# EAGLE design ace128tiny (EAGLE 9.6.2)
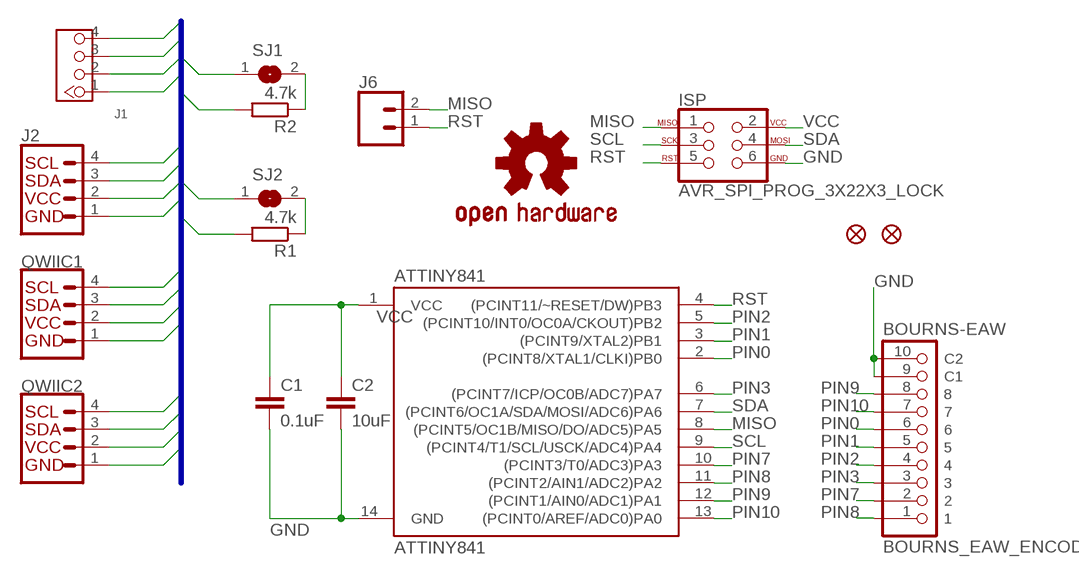
[diagram p0: schematic, sheet 1]

## Parts
ATTINY841  ATTINY841  ATTINY84  [SO14]
BOURNS_EAW_ENCODER  BOURNS-EAW  [BOURNS-EAW]
C1  0.1uF  C-EUC0603  [C0603]
C2  10uF  C-EUC0805  [C0805]
FD1  FIDUCIAL1X2  [FIDUCIAL-1X2]
FD2  FIDUCIAL1X2  [FIDUCIAL-1X2]
ISP  AVR_SPI_PROG_3X22X3_LOCK  [2X3_LOCK]
J1  GROVE I2C  GROVE-CONNECTOR-DIP(4P-2.0)HW4-2.0-NO-OUTLINE  [HW4-2.0-NO-OUTLINE]
J2  I2C_STANDARD  [1X04]
J6  CONN_02  [1X02]
LOGO1  OSHW-LOGOS  [OSHW-LOGO-S]
QWIIC1  QWIIC_CONNECTORJS-1MM  [1X04_1MM_RA]
QWIIC2  QWIIC_CONNECTORJS-1MM  [1X04_1MM_RA]
R1  4.7k  R-EU_R0603  [R0603]
R2  4.7k  R-EU_R0603  [R0603]
SJ1  SJ  [SJ]
SJ2  SJ  [SJ]

## Nets
GND: ATTINY841.14(GND) BOURNS_EAW_ENCODER.9(C1) BOURNS_EAW_ENCODER.10(C2) C1.2 C2.2 ISP.6 J1.4 J2.1 QWIIC1.1(GND) QWIIC2.1(GND)
MISO: ATTINY841.8((PCINT5/OC1B/MISO/DO/ADC5)PA5) ISP.1 J6.2
N$1: R2.1 SJ1.2
N$10: R1.1 SJ2.2
PIN0: ATTINY841.2((PCINT8/XTAL1/CLKI)PB0) BOURNS_EAW_ENCODER.6
PIN1: ATTINY841.3((PCINT9/XTAL2)PB1) BOURNS_EAW_ENCODER.5
PIN2: ATTINY841.5((PCINT10/INT0/OC0A/CKOUT)PB2) BOURNS_EAW_ENCODER.4
PIN3: ATTINY841.6((PCINT7/ICP/OC0B/ADC7)PA7) BOURNS_EAW_ENCODER.3
PIN7: ATTINY841.10((PCINT3/T0/ADC3)PA3) BOURNS_EAW_ENCODER.2
PIN8: ATTINY841.11((PCINT2/AIN1/ADC2)PA2) BOURNS_EAW_ENCODER.1
PIN9: ATTINY841.12((PCINT1/AIN0/ADC1)PA1) BOURNS_EAW_ENCODER.8
PIN10: ATTINY841.13((PCINT0/AREF/ADC0)PA0) BOURNS_EAW_ENCODER.7
RST: ATTINY841.4((PCINT11/~RESET/DW)PB3) ISP.5 J6.1
SCL: ATTINY841.9((PCINT4/T1/SCL/USCK/ADC4)PA4) ISP.3 J1.1 J2.4 QWIIC1.4(SCL) QWIIC2.4(SCL) SJ1.1
SDA: ATTINY841.7((PCINT6/OC1A/SDA/MOSI/ADC6)PA6) ISP.4 J1.2 J2.3 QWIIC1.3(SDA) QWIIC2.3(SDA) SJ2.1
VCC: ATTINY841.1(VCC) C1.1 C2.1 ISP.2 J1.3 J2.2 QWIIC1.2(VCC) QWIIC2.2(VCC) R1.2 R2.2

## Buses
I2C:GND,SCL,SDA,VCC

## Library data of the parts
ATTINY841 = SparkFun-IC-Microcontroller:ATTINY84: Atmel 14-pin 2/4/8kB flash uC Datasheet <https://cdn.sparkfun.com/datasheets/Widgets/doc8006.pdf> SparkFun Products Tiny AVR Programmer <https://www.sparkfun.com/products/11801> (PGM-11801) SparkFun Servo Trigger - Continuous Rotation <https://www.sparkfun.com/products/13872> (WIG-13872) SparkFun Servo Trigger <https://www.sparkfun.com/products/13118> (WIG-13118); PROD_ID: IC-11285; VALUE: ATTINY84
BOURNS_EAW_ENCODER = redhunter:BOURNS-EAW: Bourns EAW0J-C24 Absolute Contacting Encoder (ACE)
C1 C2 = rcl:C-EU: CAPACITOR, European symbol
FD1 FD2 = SparkFun-Aesthetics:FIDUCIAL: Fiducial Alignment Points Point-of-reference for pick-and-place machines and other optical instruments.
ISP = SparkFun-Connectors:AVR_SPI_PROG_3X2: AVR ISP 6 Pin This is the reduced ISP connector for AVR programming. Common on Arduino. This footprint will take up less PCB space and can be used with a 10-pin to 6-pin adapter such as SKU: BOB-08508 **Special note about "TEST_POINT" package. The stop mask is on the top side, so if you want your programming test points to be on the bottom of your board, make sure to place this package on the bottom side of the board. This also ensure that the orientation to program from the bottom side will be correct. SparkFun Products: SparkFun ISP Pogo Adapter <https://www.sparkfun.com/products/11591> - NS Tiny AVR Programmer <https://www.sparkfun.com/products/11801> -PTH
J1 = redhunter:GROVE-CONNECTOR-DIP(4P-2.0): 320110033
J2 = SparkFun-Connectors:I2C_STANDARD: SparkFun I2C Standard Pinout Header SparkFun has standardized on a pinout for all I2C based sensor breakouts. This pinout allows I2C boards to be plugged directly into the headers on Arduino Uno compatible boards, and to be daisy chained easily. Example SparkFun Products: SparkFun Atmospheric Sensor Breakout - BME280 <https://www.sparkfun.com/products/13676> SparkFun Altitude/Pressure Sensor Breakout - MPL3115A2 <https://www.sparkfun.com/products/11084> SparkFun TOF Range Finder Sensor - VL6180 <https://www.sparkfun.com/products/12785>
J6 = SparkFun-Connectors:CONN_02: Multi connection point. Often used as Generic Header-pin footprint for 0.1 inch spaced/style header connections On any of the 0.1 inch spaced packages, you can populate with these: Break Away Headers - Straight <https://www.sparkfun.com/products/116> (PRT-00116) Break Away Male Headers - Right Angle <https://www.sparkfun.com/products/553> (PRT-00553) Female Headers <https://www.sparkfun.com/products/115> (PRT-00115) Break Away Headers - Machine Pin <https://www.sparkfun.com/products/117> (PRT-00117) Break Away Female Headers - Swiss Machine Pin <https://www.sparkfun.com/products/743> (PRT-00743) For SCREWTERMINALS and SPRING TERMINALS visit here: Screw Terimnals on SparkFun.com <https://www.sparkfun.com/search/results?term=Screw+Terminals> (5mm/3.5mm/2.54mm spacing) This device is also useful as a general connection point to wire up your design to another part of your project. Our various solder wires solder well into these plated through hole pads. Hook-Up Wire - Assortment (Stranded, 22 AWG) <https://www.sparkfun.com/products/11375> (PRT-11375) Hook-Up Wire - Assortment (Solid Core, 22 AWG) <https://www.sparkfun.com/products/11367> (PRT-11367) View the entire wire category on our website here <https://www.sparkfun.com/categories/141> Special notes: Molex polarized connector foot print use with: PRT-08233 with associated crimp pins and housings. 2.54_SCREWTERM for use with PRT-10571. 3.5mm Screw Terminal footprints for PRT-08084 5mm Screw Terminal footprints for use with PRT-08432
LOGO1 = SparkFun-Aesthetics:OSHW-LOGO: Open-Source Hardware (OSHW) Logo This logo indicates the piece of hardware it is found on incorporates a OSHW license and/or adheres to the definition of open source hardware found here: http://freedomdefined.org/OSHW
QWIIC1 QWIIC2 = SparkFun-Connectors:QWIIC_CONNECTOR: SparkFun I2C Standard Qwiic Connector An SMD 1mm pitch JST connector makes it easy and quick (get it? Qwiic?) to connect I2C devices to each other. The Qwiic system <http://www.sparkfun.com/qwiic> enables fast and solderless connection between popular platforms and various sensors and actuators. We carry 200mm <https://www.sparkfun.com/products/14204>, 100mm <https://www.sparkfun.com/products/14205>, 50mm <https://www.sparkfun.com/products/14206>, and breadboard friendly <https://www.sparkfun.com/products/14207> Qwiic cables. We also offer 10 pcs strips <https://www.sparkfun.com/products/14323> the SMD connectors.
R1 R2 = rcl:R-EU_: RESISTOR, European symbol; SPICEPREFIX: R
SJ1 SJ2 = jumper:SJ: SMD solder JUMPER

## Board
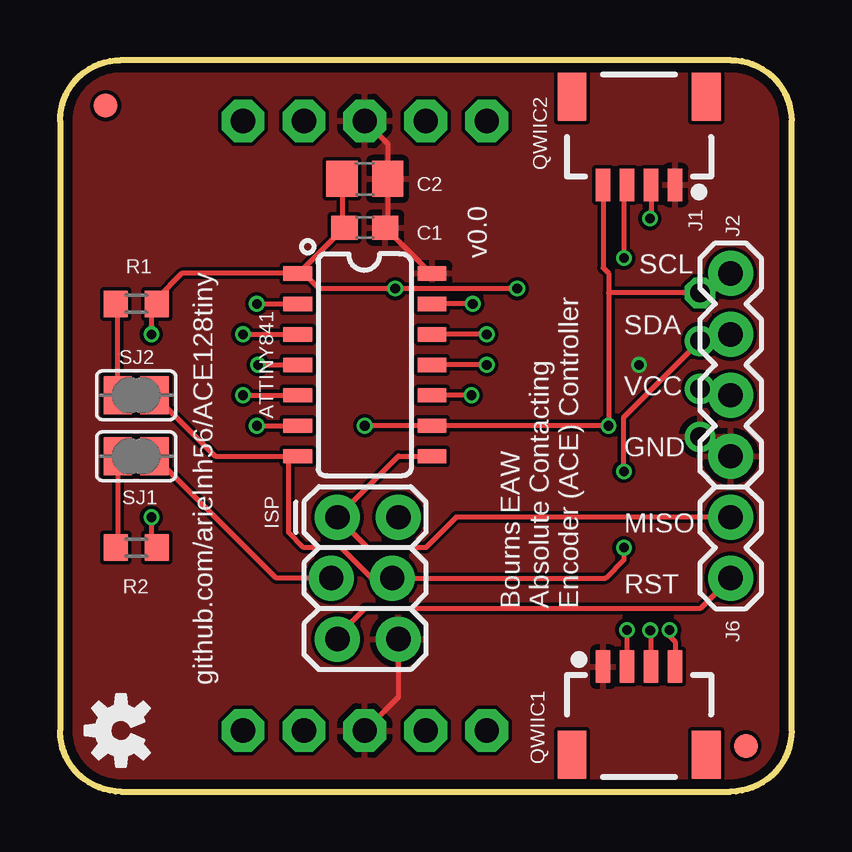
[diagram p1: board, top side]
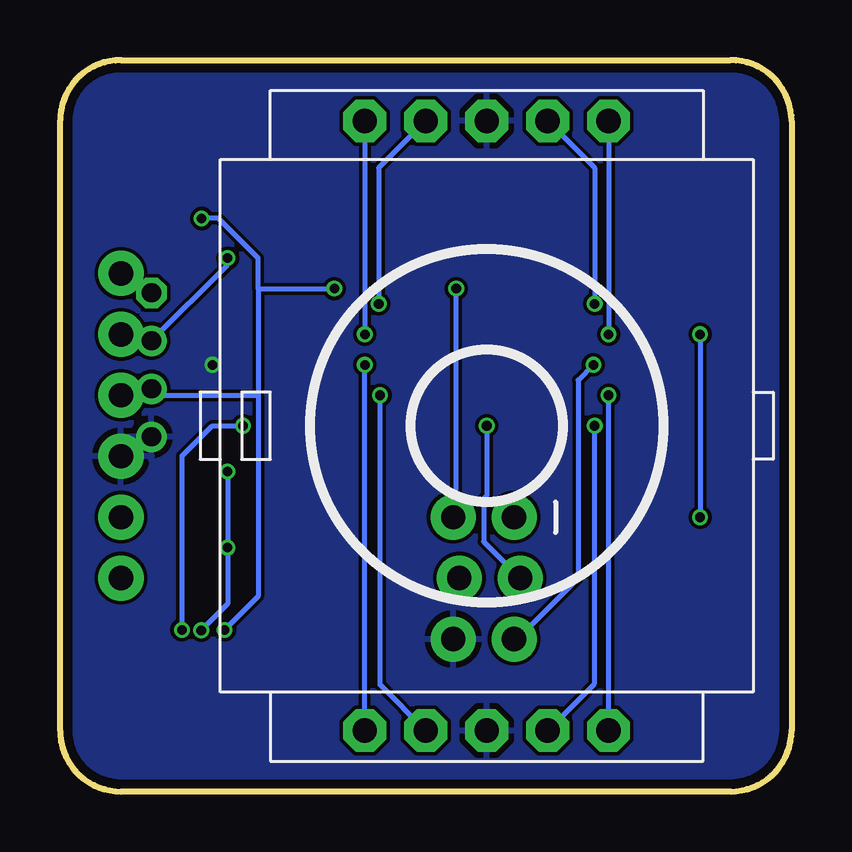
[diagram p2: board, bottom side, seen from below]

Size 30.48 x 30.48 mm. Coordinates in mm from the lower left corner, seen from the top.
Outline: 2.54,0 27.94,0 arc90 30.48,2.54 30.48,27.94 arc90 27.94,30.48 2.54,30.48 arc90 0,27.94 0,2.54 arc90 2.54,0
Copper layers (1*16): Top 0.035559375mm / dielectric 1.6mm / Bottom 0.035559375mm
Design rules "oshpark-2layer *": minimum track width 6mil, minimum drill 10mil, track to track 6mil, track to pad 6mil, pad to pad 6mil, via to via 6mil, smd to smd 6mil, copper to edge 15mil, drill to drill 6mil, minimum pad ring 5mil, minimum via ring 5mil, stop-mask expansion 2.5mil, vias tented up to drill 24mil, thermal gap 10mil

### Footprints (pad centres in the part's own frame; a part is rotated, then mirrored left to right if it is on the bottom)
SO14 = smd 0.6 x 1.2: 1 -3.175,-2.8; 2 -1.905,-2.8; 3 -0.635,-2.8; 4 0.635,-2.8; 5 1.905,-2.8; 6 3.175,-2.8; 7 4.445,-2.8; 8 4.445,2.8; 9 3.175,2.8; 10 1.905,2.8; 11 0.635,2.8; 12 -0.635,2.8; 13 -1.905,2.8; 14 -3.175,2.8
BOURNS-EAW = drill 1.016 pad 1.778 octagon: 1 -5.08,-12.7; 2 -2.54,-12.7; 3 2.54,-12.7; 4 5.08,-12.7; 5 5.08,12.7; 6 2.54,12.7; 7 -2.54,12.7; 8 -5.08,12.7; 9 0,-12.7; 10 0,12.7
C0603 = smd 1.1 x 1: 1 -0.85,0; 2 0.85,0
C0805 = smd 1.3 x 1.5: 1 -0.95,0; 2 0.95,0
FIDUCIAL-1X2 = smd 1 x 1: 1 0,0
2X3_LOCK = drill 1.016 pad 1.88: 1 0,0.127; 2 0,2.667; 3 2.54,-0.127; 4 2.54,2.413; 5 5.08,0.127; 6 5.08,2.667
HW4-2.0-NO-OUTLINE = drill 0.8 pad 1.27 octagon: 1 -3,0 | drill 0.8 pad 1.27: 2 -1,0; 3 1,0; 4 3,0
1X04 = drill 1.016 pad 1.88: 1 0,0; 2 2.54,0; 3 5.08,0; 4 7.62,0
1X02 = drill 1.016 pad 1.88: 1 0,0; 2 2.54,0
1X04_1MM_RA = smd 0.6 x 1.35: 1 -1.5,0; 2 -0.5,0; 3 0.5,0; 4 1.5,0 | smd 1.2 x 2: NC1 2.8,-3.675; NC2 -2.8,-3.675
R0603 = smd 1 x 1.1: 1 -0.85,0; 2 0.85,0
SJ = smd 1.168 x 1.6: 1 -0.762,0; 2 0.762,0

### Placement (x,y rotation side)
ATTINY841  12.7,18.41 270 top
BOURNS_EAW_ENCODER  12.7,15.24 0 bottom
C1  12.7,23.5 0 top
C2  12.7,25.53 0 top
FD1  28.57,1.91 0 top
FD2  1.91,28.57 0 top
ISP  11.43,11.43 270 top
J1  26.67,17.78 270 top
J2  27.94,13.97 90 top
J6  27.94,8.89 90 top
LOGO1  2.54,2.54 90 top
QWIIC1  24.13,5.21 0 top
QWIIC2  24.13,25.27 180 top
R1  3.17,20.32 0 top
R2  3.17,10.16 0 top
SJ1  3.17,13.97 180 top
SJ2  3.17,16.51 180 top

### Tracks (layer width: path | path; a pad name or v marks a point on that pad's centre or on a via)
GND  (via drill 0.4)
  Top 0.203: J2.1 27.48,13.97 J1.4 | ISP.6 14.1,3.94 BOURNS_EAW_ENCODER.9 | BOURNS_EAW_ENCODER.10 13.65,26.99 C2.2 13.65,23.59 C1.2 15.46,21.59 ATTINY841.14
  other vias: 24.13,17.78
  pour Top: 0,30.48 0,0 30.48,0 30.48,30.48
  pour Bottom: 0,30.48 30.48,30.48 30.48,0 0,0
MISO
  Top 0.203: J6.2 16.51,11.43 15.24,10.16 12.83,10.16 ISP.1 14.1,13.97 ATTINY841.8
N$1
  Top 0.203: SJ1.2 2.41,10.25 R2.1
N$10
  Top 0.203: SJ2.2 2.41,20.23 R1.1
PIN0  (via drill 0.4)
  Top 0.203: v8.2,20.32 ATTINY841.2
  Bottom 0.203: v8.2,20.32 8.2,25.98 BOURNS_EAW_ENCODER.6
PIN1  (via drill 0.4)
  Top 0.203: v7.62,19.05 ATTINY841.3
  Bottom 0.203: BOURNS_EAW_ENCODER.5 v7.62,19.05
PIN2  (via drill 0.4)
  Top 0.203: v7.62,16.51 ATTINY841.5
  Bottom 0.203: BOURNS_EAW_ENCODER.4 v7.62,16.51
PIN3  (via drill 0.4)
  Top 0.203: v8.2,15.24 ATTINY841.6
  Bottom 0.203: BOURNS_EAW_ENCODER.3 8.2,4.5 v8.2,15.24
PIN7  (via drill 0.4)
  Top 0.203: v17.14,16.51 ATTINY841.10
  Bottom 0.203: BOURNS_EAW_ENCODER.2 17.14,4.45 v17.14,16.51
PIN8  (via drill 0.4)
  Top 0.203: v17.78,17.78 ATTINY841.11
  Bottom 0.203: BOURNS_EAW_ENCODER.1 v17.78,17.78
PIN9  (via drill 0.4)
  Top 0.203: v17.78,19.05 ATTINY841.12
  Bottom 0.203: BOURNS_EAW_ENCODER.8 v17.78,19.05
PIN10  (via drill 0.4)
  Top 0.203: v17.2,20.32 ATTINY841.13
  Bottom 0.203: BOURNS_EAW_ENCODER.7 17.2,25.98 v17.2,20.32
RST  (via drill 0.4)
  Top 0.203: J6.1 26.67,7.62 12.7,7.62 11.56,6.48 ISP.5 | v8.26,17.78 ATTINY841.4
  Bottom 0.203: ISP.5 11.43,6.35 8.89,8.89 8.89,17.14 v8.26,17.78
SCL  (via drill 0.4)
  Top 0.203: ISP.3 9.02,8.89 SJ1.1 | J2.4 27.13,20.78 J1.1 22.86,20.78 | v25.4,6.73 25.4,6.48 25.63,6.25 QWIIC1.4 | 22.86,20.78 v22.86,15.24 ATTINY841.9 v12.7,15.24 | QWIIC2.4 22.63,21.82 22.86,21.59 22.86,20.78
  Bottom 0.203: v25.4,6.73 25.4,13.97 24.13,15.24 v22.86,15.24 | v12.7,15.24 12.7,12.33 12.83,12.2 12.83,10.41 ISP.3
SDA  (via drill 0.4)
  Top 0.203: J2.3 27.67,18.78 J1.2 23.5,15.61 v23.5,13.34 | QWIIC1.3 24.63,6.68 v24.59,6.72 | QWIIC2.3 23.5,25.14 v23.5,22.23 | v23.5,10.16 23.5,9.65 22.73,8.89 ISP.4 12.99,8.89 11.72,10.16 10.16,10.16 9.53,10.79 9.53,13.97 | SJ2.1 6.48,13.97 9.53,13.97 | 9.53,13.97 ATTINY841.7
  Bottom 0.203: v24.59,6.72 23.5,7.81 v23.5,10.16 v23.5,13.34 | J1.2 23.5,21.95 v23.5,22.23
VCC  (via drill 0.4)
  Top 0.203: J2.2 26.94,16.51 J1.3 | C2.1 11.75,23.59 C1.1 9.95,21.59 ATTINY841.1 | ATTINY841.1 5.08,21.59 4.03,20.54 R1.2 3.81,20.32 v3.81,19.05 | ATTINY841.1 10.16,21.59 10.79,20.95 v13.97,20.95 v19.05,20.95 | v3.81,11.43 3.81,10.38 R2.2 | QWIIC1.2 v23.63,6.72 v23.62,6.73 | QWIIC2.2 24.63,23.93 v24.58,23.88
  Bottom 0.203: ISP.2 13.97,11.56 v13.97,20.95 | 22.23,20.95 v19.05,20.95 | 22.23,20.95 22.23,22.23 23.88,23.88 v24.58,23.88 | v3.81,19.05 v3.81,11.43 | 22.23,20.95 22.23,16.51 | 22.23,16.51 22.23,8.13 v23.62,6.73 | J1.3 26.4,16.51 22.23,16.51

### Text on the board
tPlace: v0.0 | SCL | SDA | VCC | GND | MISO | Bourns EAW / Absolute Contacting / Encoder (ACE) Controller | RST | github.com/arielnh56/ACE128tiny